# EAGLE schematic poppy (EAGLE 6.4)
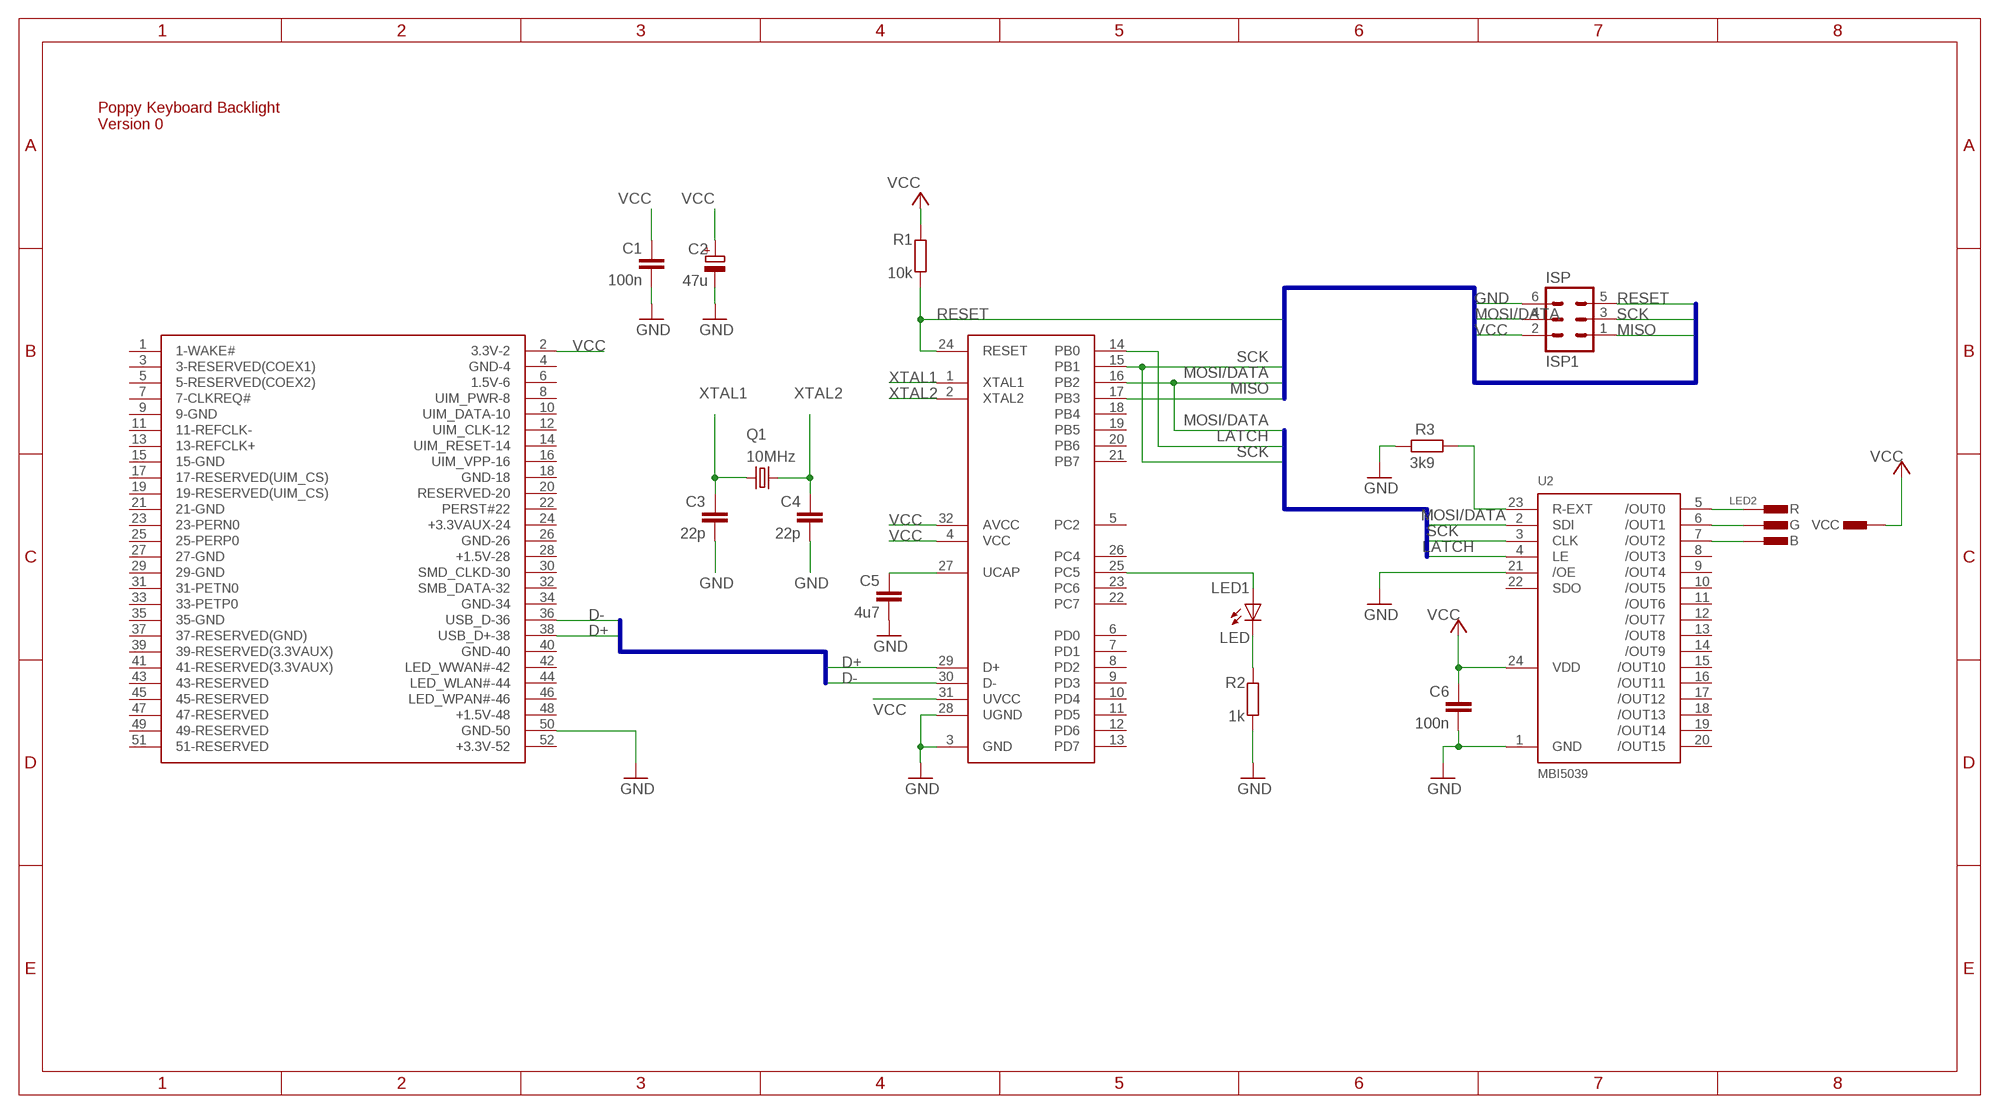
[diagram p0: schematic, sheet 1]

## Parts
C1  100n  C-EUC4532  [C4532]
C2  47u  CPOL-EU150CLZ-0810  [150CLZ-0810]
C3  22p  C-EUC1206K  [C1206K]
C4  22p  C-EUC1206K  [C1206K]
C5  4u7  C-EUC1206K  [C1206K]
C6  100n  C-EUC1206K  [C1206K]
EDGE  FULL-MINI-PCI-E  [FULL-MINI-PCI-E]
ISP  ISP1  MA03-2  [MA03-2]
LED1  LED  LEDCHIPLED_0805  [CHIPLED_0805]
LED2  CON-RGB-LED-EXT  [CON-RGB-LED-TH-EXT]
Q1  10MHz  CRYSTALCTS406  [CTS406]
R1  10k  R-EU_R1206  [R1206]
R2  1k  R-EU_R1206  [R1206]
R3  3k9  R-EU_R1206  [R1206]
U1  ATUSB  AT90USB162  [VQFP32]
U2  MBI5039  MBI5039SOP24-300-1.00  [SOP24-300-1.00]

## Nets
D+: EDGE.38(USB_D+-38) U1.29(D+)
D-: EDGE.36(USB_D-36) U1.30(D-)
GND: C1.2 C2.- C3.2 C4.2 C5.2 C6.2 EDGE.50(GND-50) ISP.6 R2.1 R3.1 U1.3(GND) U1.28(UGND) U2.1(GND) U2.21(/OE)
LATCH: U1.14(PB0) U2.4(LE)
MISO: ISP.1 U1.17(PB3)
MOSI/DATA: ISP.4 U1.16(PB2) U2.2(SDI)
N$1: LED1.A U1.25(PC5)
N$2: R3.2 U2.23(R-EXT)
N$3: LED2.3.R(R) U2.5(/OUT0)
N$4: C5.1 U1.27(UCAP)
N$5: LED2.2.G(G) U2.6(/OUT1)
N$6: LED2.1.B(B) U2.7(/OUT2)
N$7: LED1.C R2.2
RESET: ISP.5 R1.1 U1.24(RESET)
SCK: ISP.3 U1.15(PB1) U2.3(CLK)
VCC: C1.1 C2.+ C6.1 EDGE.2(3.3V-2) ISP.2 LED2.4.VCC(VCC) R1.2 U1.4(VCC) U1.31(UVCC) U1.32(AVCC) U2.24(VDD)
XTAL1: C3.1 Q1.1 U1.1(XTAL1)
XTAL2: C4.1 Q1.3 U1.2(XTAL2)
Unconnected: EDGE.1(1-WAKE#) EDGE.3(3-RESERVED(COEX1)) EDGE.4(GND-4) EDGE.5(5-RESERVED(COEX2)) EDGE.6(1.5V-6) EDGE.7(7-CLKREQ#) EDGE.8(UIM_PWR-8) EDGE.9(9-GND) EDGE.10(UIM_DATA-10) EDGE.11(11-REFCLK-) EDGE.12(UIM_CLK-12) EDGE.13(13-REFCLK+) EDGE.14(UIM_RESET-14) EDGE.15(15-GND) EDGE.16(UIM_VPP-16) EDGE.17(17-RESERVED(UIM_CS)) EDGE.18(GND-18) EDGE.19(19-RESERVED(UIM_CS)) EDGE.20(RESERVED-20) EDGE.21(21-GND) EDGE.22(PERST#22) EDGE.23(23-PERN0) EDGE.24(+3.3VAUX-24) EDGE.25(25-PERP0) EDGE.26(GND-26) EDGE.27(27-GND) EDGE.28(+1.5V-28) EDGE.29(29-GND) EDGE.30(SMD_CLKD-30) EDGE.31(31-PETN0) EDGE.32(SMB_DATA-32) EDGE.33(33-PETP0) EDGE.34(GND-34) EDGE.35(35-GND) EDGE.37(37-RESERVED(GND)) EDGE.39(39-RESERVED(3.3VAUX)) EDGE.40(GND-40) EDGE.41(41-RESERVED(3.3VAUX)) EDGE.42(LED_WWAN#-42) EDGE.43(43-RESERVED) EDGE.44(LED_WLAN#-44) EDGE.45(45-RESERVED) EDGE.46(LED_WPAN#-46) EDGE.47(47-RESERVED) EDGE.48(+1.5V-48) EDGE.49(49-RESERVED) EDGE.51(51-RESERVED) EDGE.52(+3.3V-52) U1.5(PC2) U1.6(PD0) U1.7(PD1) U1.8(PD2) U1.9(PD3) U1.10(PD4) U1.11(PD5) U1.12(PD6) U1.13(PD7) U1.18(PB4) U1.19(PB5) U1.20(PB6) U1.21(PB7) U1.22(PC7) U1.23(PC6) U1.26(PC4) U2.8(/OUT3) U2.9(/OUT4) U2.10(/OUT5) U2.11(/OUT6) U2.12(/OUT7) U2.13(/OUT8) U2.14(/OUT9) U2.15(/OUT10) U2.16(/OUT11) U2.17(/OUT12) U2.18(/OUT13) U2.19(/OUT14) U2.20(/OUT15) U2.22(SDO)

## Buses
D+,D-
MISO,MOSI/DATA,SCK,RESET,VCC,GND
MOSI/DATA,LATCH,SCK

## Notes on the sheet
- Poppy Keyboard Backlight
  Version 0

## Power pins joined to a net without a drawn wire
GND: EDGE.GND@1(GND) EDGE.GND@2(GND)

## Library data of the parts
C1 C3-C6 = resistor:C-EU: CAPACITOR, European symbol
C2 = resistor:CPOL-EU: POLARIZED CAPACITOR, European symbol
EDGE = mini-pci-e:FULL-MINI-PCI-E
ISP = con-lstb:MA03-2: PIN HEADER; OC_FARNELL: unknown; OC_NEWARK: unknown
LED1 = led:LED: LED OSRAM: - CHIPLED LG R971, LG N971, LY N971, LG Q971, LY Q971, LO R971, LY R971 LH N974, LH R974 LS Q976, LO Q976, LY Q976 LO Q996 - Hyper CHIPLED LW Q18S LB Q993, LB Q99A, LB R99A - SideLED LS A670, LO A670, LY A670, LG A670, LP A670 LB A673, LV A673, LT A673, LW A673 LH A674 LY A675 LS A676, LA A676, LO A676, LY A676, LW A676 LS A679, LY A679, LG A679 - Hyper Micro SIDELED® LS Y876, LA Y876, LO Y876, LY Y876 LT Y87S - SmartLED LW L88C, LW L88S LB L89C, LB L89S, LG L890 LS L89K, LO L89K, LY L89K LS L896, LA L896, LO L896, LY L896 - TOPLED LS T670, LO T670, LY T670, LG T670, LP T670 LSG T670, LSP T670, LSY T670, LOP T670, LYG T670 LG T671, LOG T671, LSG T671 LB T673, LV T673, LT T673, LW T673 LH T674 LS T676, LA T676, LO T676, LY T676, LB T676, LH T676, LSB T676, LW T676 LB T67C, LV T67C, LT T67C, LS T67K, LO T67K, LY T67K, LW E67C LS E67B, LA E67B, LO E67B, LY E67B, LB E67C, LV E67C, LT E67C LW T67C LS T679, LY T679, LG T679 LS T770, LO T770, LY T770, LG T770, LP T770 LB T773, LV T773, LT T773, LW T773 LH T774 LS E675, LA E675, LY E675, LS T675 LS T776, LA T776, LO T776, LY T776, LB T776 LHGB T686 LT T68C, LB T68C - Hyper Mini TOPLED® LB M676 - Mini TOPLED Santana® LG M470 LS M47K, LO M47K, LY M47K Source: http://www.osram.convergy.de LUXEON: - LUMILED® LXK2-PW12-R00, LXK2-PW12-S00, LXK2-PW14-U00, LXK2-PW14-V00 LXK2-PM12-R00, LXK2-PM12-S00, LXK2-PM14-U00 LXK2-PE12-Q00, LXK2-PE12-R00, LXK2-PE12-S00, LXK2-PE14-T00, LXK2-PE14-U00 LXK2-PB12-K00, LXK2-PB12-L00, LXK2-PB12-M00, LXK2-PB14-N00, LXK2-PB14-P00, LXK2-PB14-Q00 LXK2-PR12-L00, LXK2-PR12-M00, LXK2-PR14-Q00, LXK2-PR14-R00 LXK2-PD12-Q00, LXK2-PD12-R00, LXK2-PD12-S00 LXK2-PH12-R00, LXK2-PH12-S00 LXK2-PL12-P00, LXK2-PL12-Q00, LXK2-PL12-R00 Source: www.luxeon.com KINGBRIGHT: KA-3528ASYC Source: www.kingbright.com
LED2 = _led-rgb:CON-RGB-LED
Q1 = crystal:CRYSTAL: CRYSTAL; OC_FARNELL: unknown; OC_NEWARK: unknown
R1-R3 = resistor:R-EU_: RESISTOR, European symbol
U1 = at90usb:AT90USB162
U2 = _LedDrivers:MBI5039

## Net classes
0 default: clearance 0.355 mm